# EAGLE design TURBIDITY_SENSOR (EAGLE 8.4.1)
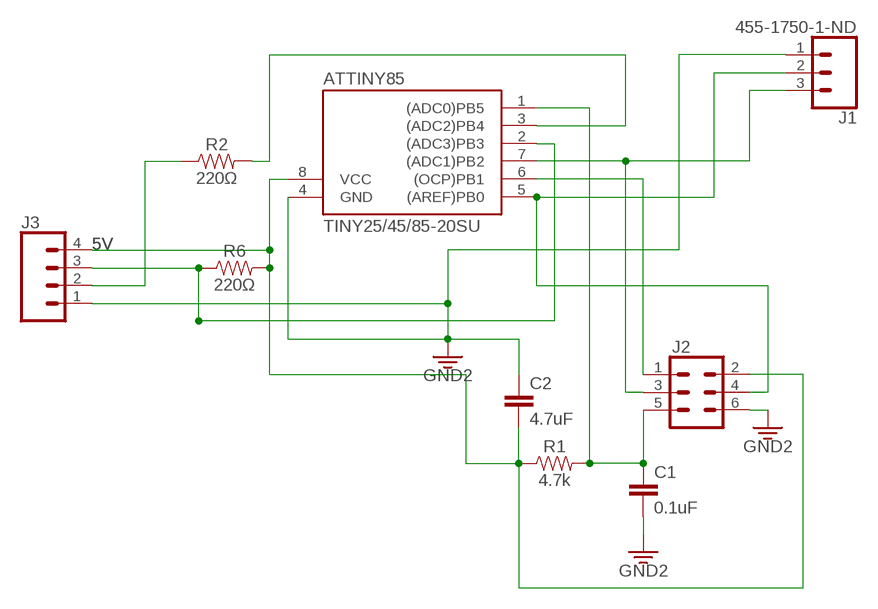
[diagram p0: schematic, sheet 1]

## Parts
ATTINY85  TINY25/45/85-20SU  [SOIC8]
C1  0.1uF  0.1UF-0603-25V-(+80/-20%)  [0603]
C2  4.7uF  4.7UF-1206-16V-(+80/-20%)  [1206]
J1  455-1750-1-ND  CONN_03  [1X03]
J2  CONN_03X22X3_SILK_MALE_PTH  [2X3]
J3  CONN_04  [1X04]
R1  4.7k  4.7KOHM-0603-1/10W-1%  [0603]
R2  220Ω  220OHM-0603-1/10W-1%  [0603]
R6  220Ω  220OHM-0603-1/10W-1%  [0603]

## Nets
5V: ATTINY85.8(VCC) C2.2 J2.2 J3.4 R1.1 R6.2
DETECT: ATTINY85.2((ADC3)PB3) J3.3 R6.1
EMIT: ATTINY85.3((ADC2)PB4) R2.2
EMIT_OUT: J3.2 R2.1
GND: ATTINY85.4(GND) C1.2 C2.1 J1.1 J2.6 J3.1 ; supply symbol labelled GND2
MISO: ATTINY85.6((OCP)PB1) J2.1
MOSI: ATTINY85.5((AREF)PB0) J1.2 J2.4
RESET: ATTINY85.1((ADC0)PB5) C1.1 J2.5 R1.2
SCK: ATTINY85.7((ADC1)PB2) J1.3 J2.3

## Library data of the parts
ATTINY85 = avr-7:TINY25/45/85
C1 = SparkFun-Capacitors:0.1UF: 0.1µF ceramic capacitors A capacitor is a passive two-terminal electrical component used to store electrical energy temporarily in an electric field.; PROD_ID: CAP-00810
C2 = SparkFun-Capacitors:4.7UF: 4.7µF ceramic capacitors A capacitor is a passive two-terminal electrical component used to store electrical energy temporarily in an electric field.; PROD_ID: CAP-10300
J1 = SparkFun-Connectors:CONN_03: Multi connection point. Often used as Generic Header-pin footprint for 0.1 inch spaced/style header connections On any of the 0.1 inch spaced packages, you can populate with these: Break Away Headers - Straight <https://www.sparkfun.com/products/116> (PRT-00116) Break Away Male Headers - Right Angle <https://www.sparkfun.com/products/553> (PRT-00553) Female Headers <https://www.sparkfun.com/products/115> (PRT-00115) Break Away Headers - Machine Pin <https://www.sparkfun.com/products/117> (PRT-00117) Break Away Female Headers - Swiss Machine Pin <https://www.sparkfun.com/products/743> (PRT-00743) Stackable Header - 3 Pin (Female, 0.1") <https://www.sparkfun.com/products/13875> (PRT-13875) For SCREWTERMINALS and SPRING TERMINALS visit here: Screw Terimnals on SparkFun.com <https://www.sparkfun.com/search/results?term=Screw+Terminals> (5mm/3.5mm/2.54mm spacing) This device is also useful as a general connection point to wire up your design to another part of your project. Our various solder wires solder well into these plated through hole pads. Hook-Up Wire - Assortment (Stranded, 22 AWG) <https://www.sparkfun.com/products/11375> (PRT-11375) Hook-Up Wire - Assortment (Solid Core, 22 AWG) <https://www.sparkfun.com/products/11367> (PRT-11367) View the entire wire category on our website here <https://www.sparkfun.com/categories/141> Special notes: Molex polarized connector foot print use with SKU : PRT-08232 with associated crimp pins and housings.; PROD_ID: XXX-00000
J2 = SparkFun-Connectors:CONN_03X2: Multi connection point. Often used as Generic Header-pin footprint for 0.1 inch spaced/style header connections You can populate with any combo of single row headers, but if you'd like an exact match, check these: Header - 2x3 (Male, 0.1") <https://www.sparkfun.com/products/12807> (PRT-12807) Header - 2x3 (Female, 0.1") <https://www.sparkfun.com/products/13010> (PRT-13010) 2x3 Pin Shrouded Header <https://www.sparkfun.com/products/10877> (PRT-10877) On any of the 0.1 inch spaced packages, you can populate with these: Break Away Headers - Straight <https://www.sparkfun.com/products/116> (PRT-00116) Break Away Male Headers - Right Angle <https://www.sparkfun.com/products/553> (PRT-00553) Female Headers <https://www.sparkfun.com/products/115> (PRT-00115) Break Away Headers - Machine Pin <https://www.sparkfun.com/products/117> (PRT-00117) Break Away Female Headers - Swiss Machine Pin <https://www.sparkfun.com/products/743> (PRT-00743) Special note: the shrouded connector mates well with our 3x2 ribbon cables: Ribbon Crimp Connector - 6-pin (2x3, Female) <https://www.sparkfun.com/products/10651> (PRT-10651) Ribbon Cable - 6 wire (15ft) <https://www.sparkfun.com/products/10646> (PRT-10646); PROD_ID: CONN-09701
J3 = SparkFun-Connectors:CONN_04: Multi connection point. Often used as Generic Header-pin footprint for 0.1 inch spaced/style header connections On any of the 0.1 inch spaced packages, you can populate with these: Break Away Headers - Straight <https://www.sparkfun.com/products/116> (PRT-00116) Break Away Male Headers - Right Angle <https://www.sparkfun.com/products/553> (PRT-00553) Female Headers <https://www.sparkfun.com/products/115> (PRT-00115) Break Away Headers - Machine Pin <https://www.sparkfun.com/products/117> (PRT-00117) Break Away Female Headers - Swiss Machine Pin <https://www.sparkfun.com/products/743> (PRT-00743) For SCREWTERMINALS and SPRING TERMINALS visit here: Screw Terimnals on SparkFun.com <https://www.sparkfun.com/search/results?term=Screw+Terminals> (5mm/3.5mm/2.54mm spacing) This device is also useful as a general connection point to wire up your design to another part of your project. Our various solder wires solder well into these plated through hole pads. Hook-Up Wire - Assortment (Stranded, 22 AWG) <https://www.sparkfun.com/products/11375> (PRT-11375) Hook-Up Wire - Assortment (Solid Core, 22 AWG) <https://www.sparkfun.com/products/11367> (PRT-11367) View the entire wire category on our website here <https://www.sparkfun.com/categories/141> Special notes: Molex polarized connector foot print use with SKU : PRT-08231 with associated crimp pins and housings. 1MM SMD Version SKU: PRT-10208; PROD_ID: CONN-09696
R1 = SparkFun-Resistors:4.7KOHM: 4.7kΩ resistor A resistor is a passive two-terminal electrical component that implements electrical resistance as a circuit element. Resistors act to reduce current flow, and, at the same time, act to lower voltage levels within circuits. - Wikipedia; PROD_ID: RES-07857
R2 R6 = SparkFun-Resistors:220OHM: 220Ω resistor A resistor is a passive two-terminal electrical component that implements electrical resistance as a circuit element. Resistors act to reduce current flow, and, at the same time, act to lower voltage levels within circuits. - Wikipedia; PROD_ID: RES-07861; VALUE: 220

## Board
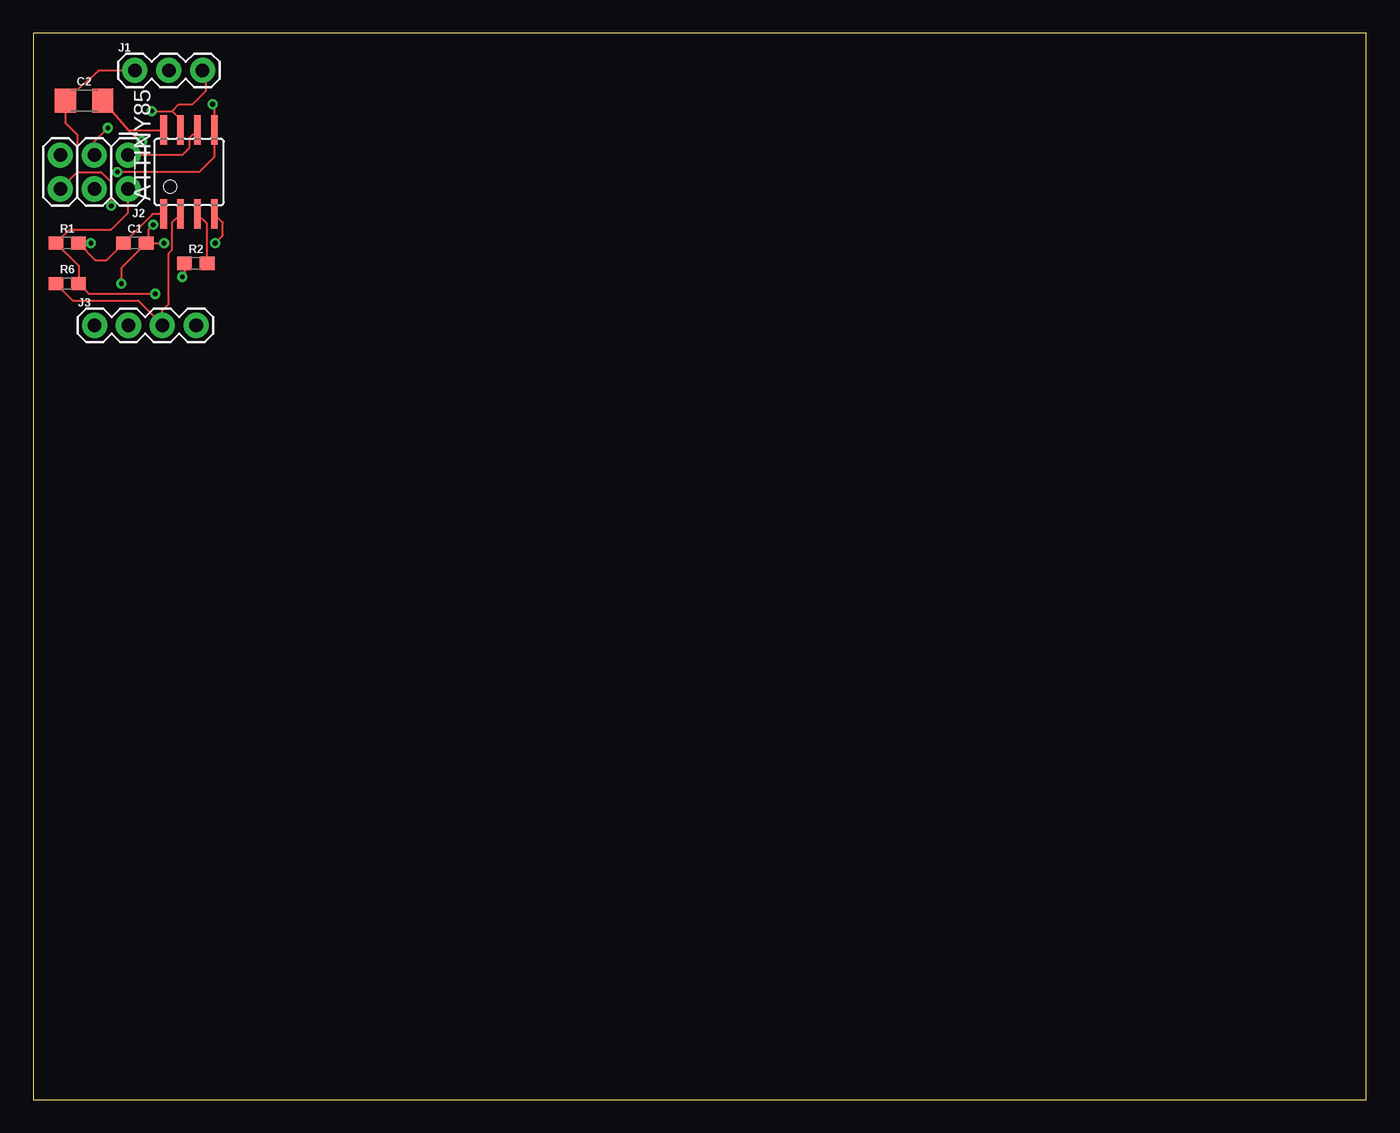
[diagram p1: board, top side]
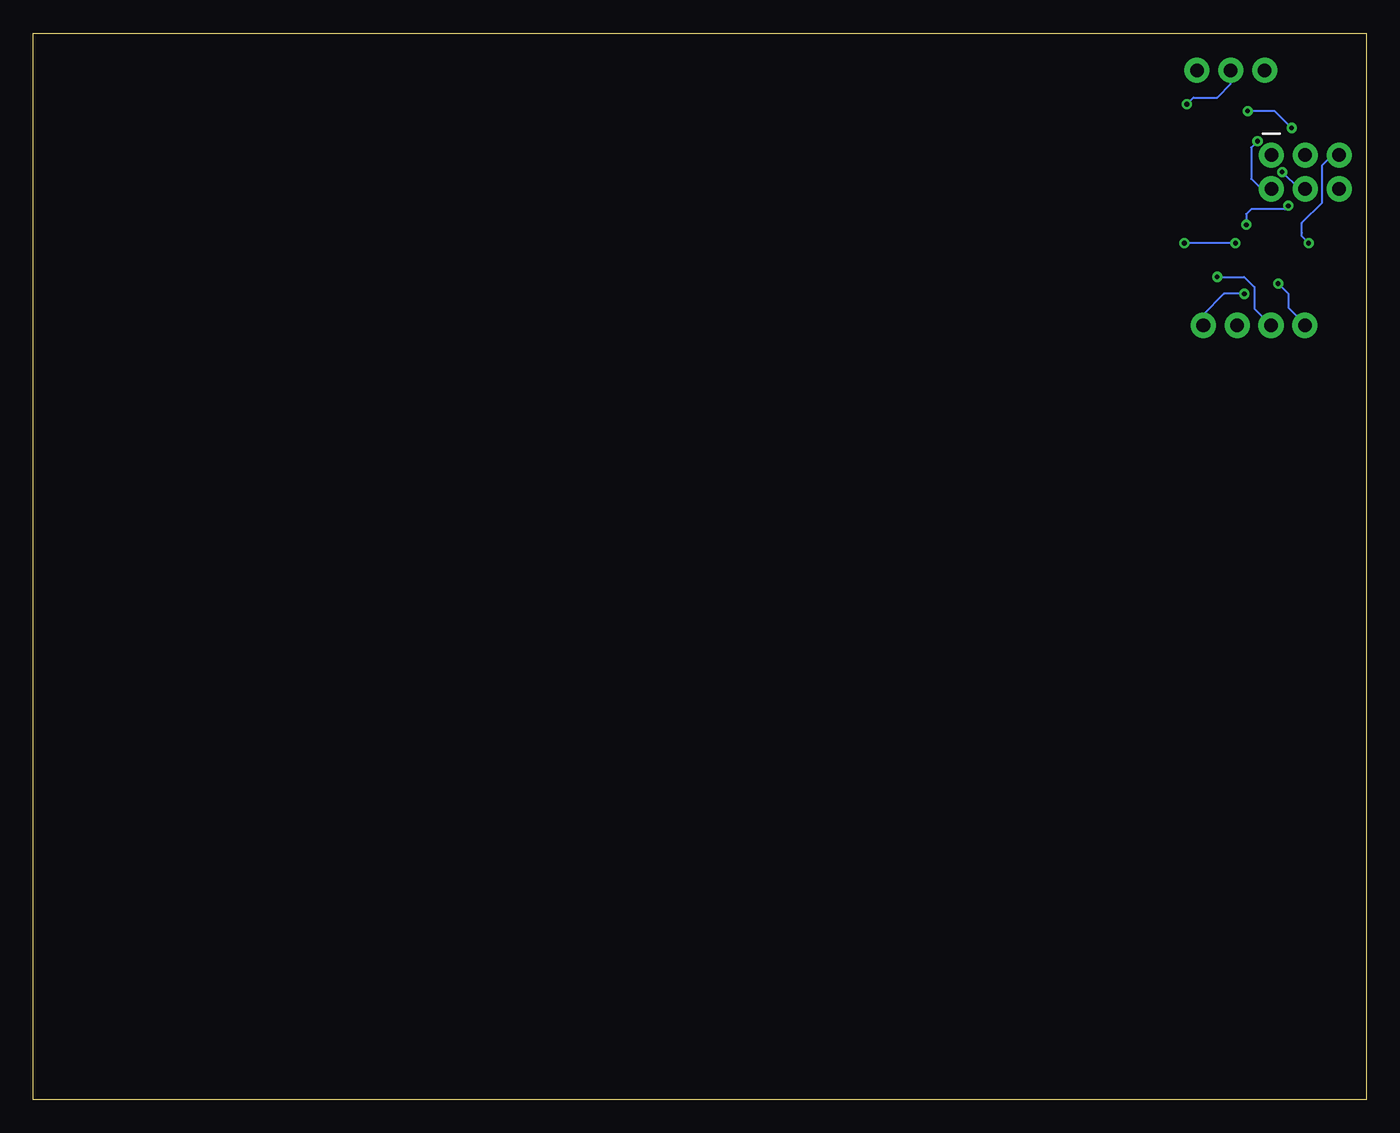
[diagram p2: board, bottom side, seen from below]

Size 100 x 80 mm. Coordinates in mm from the lower left corner, seen from the top.
Outline: 0,0 100,0 100,80 0,80 0,0
Copper layers (1*16): Top 0.035mm / dielectric 1.5mm / Bottom 0.035mm
Design rules "default": minimum track width 6mil, minimum drill 0.35mm, track to track 6mil, track to pad 6mil, pad to pad 6mil, via to via 6mil, smd to smd 6mil, copper to edge 40mil, drill to drill 6mil, minimum pad ring 10mil, minimum via ring 8mil, stop-mask expansion 4mil, vias tented up to drill 0mil, thermal gap 10mil

### Footprints (pad centres in the part's own frame; a part is rotated, then mirrored left to right if it is on the bottom)
SOIC8 = smd 0.5 x 2.2: 1 -1.905,-3.154; 2 -0.645,-3.154; 3 0.625,-3.154; 4 1.895,-3.154; 5 1.905,3.154; 6 0.635,3.154; 7 -0.635,3.154; 8 -1.905,3.154
0603 = smd 1.1 x 1: 1 -0.85,0; 2 0.85,0
1206 = smd 1.6 x 1.8: 1 -1.4,0; 2 1.4,0
1X03 = drill 1.016 pad 1.88: 1 0,0; 2 2.54,0; 3 5.08,0
2X3 = drill 1.016 pad 1.88: 1 0,0; 2 0,2.54; 3 2.54,0; 4 2.54,2.54; 5 5.08,0; 6 5.08,2.54
1X04 = drill 1.016 pad 1.88: 1 0,0; 2 2.54,0; 3 5.08,0; 4 7.62,0

### Placement (x,y rotation side)
ATTINY85  11.68,69.6 0 top
C1  7.62,64.26 0 top
C2  3.81,74.93 0 top
J1  7.62,77.22 0 top
J2  7.11,70.87 180 top
J3  4.6,58.09 0 top
R1  2.54,64.26 0 top
R2  12.19,62.74 0 top
R6  2.54,61.21 0 top

### Tracks (layer width: path | path; a pad name or v marks a point on that pad's centre or on a via)
5V  (via drill 0.35)
  Top 0.152: v9.14,60.45 4.15,60.45 R6.2 3.39,62.56 R1.1 2.71,65.28 5.84,65.28 7.11,66.55 J2.2 | C2.2 7.14,72.75 | 7.14,72.75 ATTINY85.8 | 7.14,72.75 7.98,71.91 v8.15,71.91
  Bottom 0.152: v8.15,71.91 8.64,71.42 8.64,69.09 7.87,68.33 J2.2 | v9.14,60.45 10.67,60.45 12.22,58.9 J3.4
DETECT
  Top 0.152: ATTINY85.2 10.41,65.82 10.41,63.75 10.16,63.5 10.16,59.69 9.68,59.21 J3.3 9.68,58.14 7.87,59.94 2.96,59.94 R6.1
EMIT
  Top 0.152: R2.2 13.04,65.71 ATTINY85.3
EMIT_OUT  (via drill 0.35)
  Top 0.152: R2.1 11.34,61.89 v11.18,61.72
  Bottom 0.152: v11.18,61.72 9.14,61.72 8.38,60.96 8.38,59.33 J3.2
GND  (via drill 0.35)
  Top 0.152: v6.6,61.21 6.6,62.4 C1.2 8.64,64.26 | J1.1 4.95,77.22 C2.1 2.41,73.28 3.3,72.39 3.3,69.6 | v13.65,64.26 14.22,64.84 14.22,65.8 ATTINY85.4 | 8.64,64.26 v9.81,64.26 | 3.3,69.6 J2.6 | 3.3,69.6 5.08,69.6 5.84,68.83 v5.84,67.06 | v9,65.63 8.64,65.27 8.64,64.26
  Bottom 0.152: v6.6,61.21 5.84,60.45 5.84,59.44 4.6,58.19 J3.1 | v9.81,64.26 v13.65,64.26 | v5.84,67.06 6.1,66.8 8.64,66.8 9,66.44 v9,65.63
MISO
  Top 0.152: ATTINY85.6 11.68,72.11 11.68,71.37 11.18,70.87 J2.1
MOSI  (via drill 0.35)
  Top 0.152: v6.3,69.6 12.45,69.6 13.59,70.74 ATTINY85.5 13.59,74.55 v13.46,74.68
  Bottom 0.152: v6.3,69.6 5.03,68.33 J2.4 | v13.46,74.68 12.95,75.18 11.18,75.18 10.16,76.2 J1.2
RESET  (via drill 0.35)
  Top 0.152: ATTINY85.1 8.95,66.44 C1.1 5.5,62.99 4.66,62.99 R1.2 v4.32,64.26
  Bottom 0.152: v4.32,64.26 4.83,64.77 4.83,65.02 4.83,65.79 3.3,67.31 3.3,70.1 2.54,70.87 J2.5
SCK  (via drill 0.35)
  Top 0.152: J2.3 4.57,71.88 v5.59,72.9 | v8.89,74.17 10.41,74.17 | 10.41,74.17 11.05,73.53 ATTINY85.7 | 10.41,74.17 10.92,74.68 11.94,74.68 12.95,75.69 12.95,76.96 J1.3
  Bottom 0.152: v5.59,72.9 6.86,74.17 v8.89,74.17